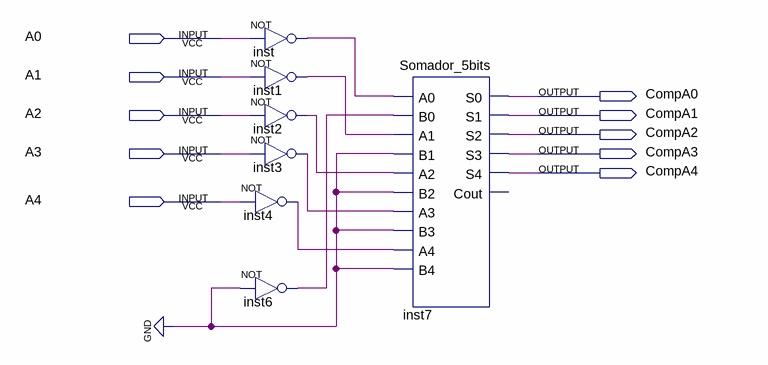
[diagram p0: schematic sheet]
// Quartus schematic Complemento_5bits.bdf as structural Verilog: 7 symbols, 10 pins
module Complemento_5bits (
  input  A0,
  input  A1,
  input  A2,
  input  A3,
  input  A4,
  output CompA0,
  output CompA1,
  output CompA2,
  output CompA3,
  output CompA4
);

  wire inst1_out, inst2_out, inst3_out, inst4_out, inst6_out, inst_out;

  not inst (inst_out, A0);
  not inst1 (inst1_out, A1);
  not inst2 (inst2_out, A2);
  not inst3 (inst3_out, A3);
  not inst4 (inst4_out, A4);
  not inst6 (inst6_out, 1'b0);
  Somador_5bits inst7 (
    .A0(inst_out), .B0(inst6_out), .A1(inst1_out), .B1(1'b0), .A2(inst2_out), .B2(1'b0), .A3(inst3_out),
    .B3(1'b0), .A4(inst4_out), .B4(1'b0), .S0(CompA0), .S1(CompA1), .S2(CompA2), .S3(CompA3), .S4(CompA4));  // open: Cout
endmodule
